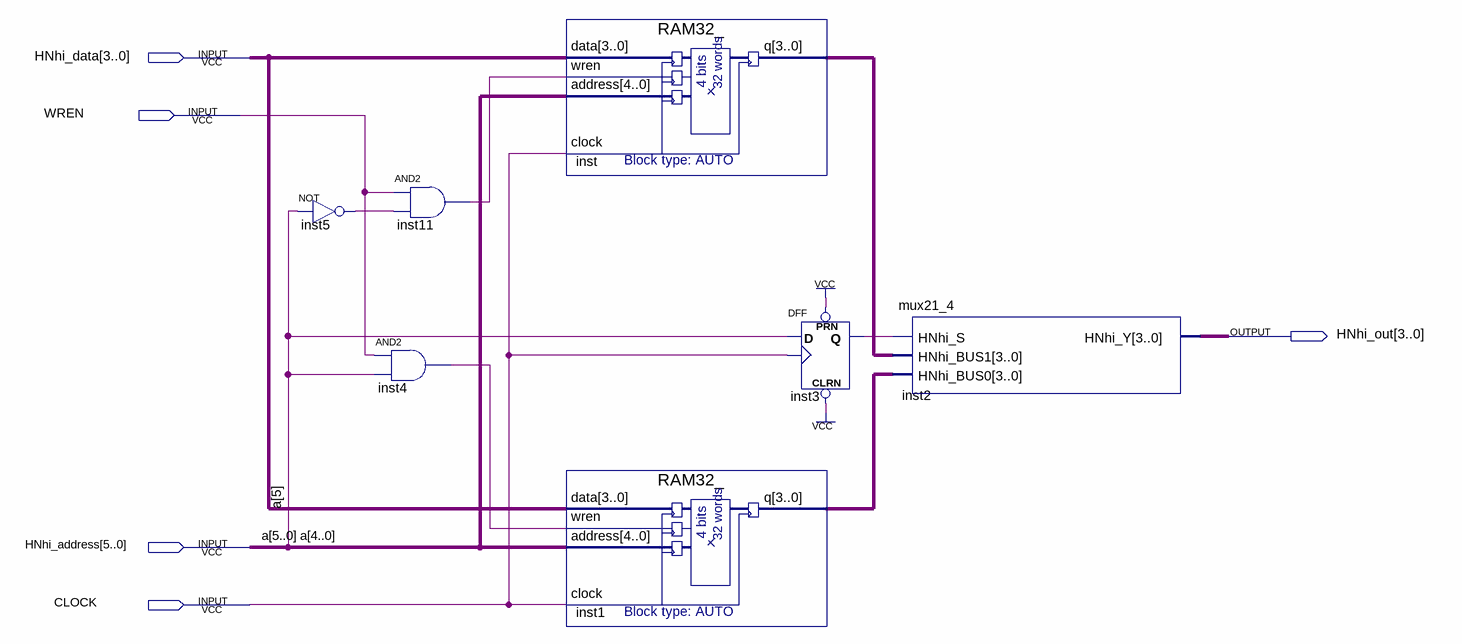
[diagram p0: schematic sheet]
// Quartus schematic Assignment8.bdf as structural Verilog: 7 symbols, 5 pins
module Assignment8 (
  input  [3:0] HNhi_data,
  input  WREN,
  input  [5:0] HNhi_address,
  input  CLOCK,
  output [3:0] HNhi_out
);

  wire inst3_q, inst4_out, inst5_out, inst11_out;
  wire [3:0] inst1_q, inst_q;

  not inst5 (inst5_out, HNhi_address[5]);
  and inst4 (inst4_out, WREN, HNhi_address[5]);
  and inst11 (inst11_out, WREN, inst5_out);
  RAM32_ inst (.data(HNhi_data), .wren(inst11_out), .address(HNhi_address[4:0]), .clock(CLOCK), .q(inst_q));
  RAM32_ inst1 (.data(HNhi_data), .wren(inst4_out), .address(HNhi_address[4:0]), .clock(CLOCK), .q(inst1_q));
  DFF inst3 (.CLRN(1'b1), .CLK(CLOCK), .D(HNhi_address[5]), .PRN(1'b1), .Q(inst3_q));
  mux21_4 inst2 (.HNhi_S(inst3_q), .HNhi_BUS1(inst_q), .HNhi_BUS0(inst1_q), .HNhi_Y(HNhi_out));

  // Other names for the same wires on the sheet: a[5:0] = HNhi_address
endmodule
